# Altium project HLib-Sensor-Accel_Gyro.PrjPcb
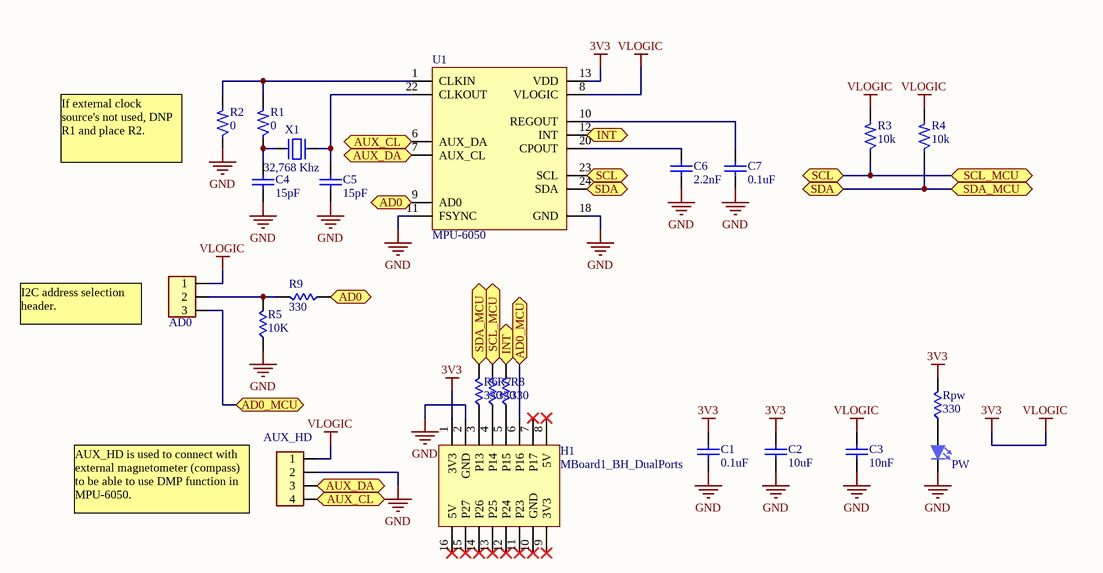
[diagram p0: HLib-Sensor-Accel_Gyro.SchDoc]
1 sheet, 23 parts. Net scope: flat (ports and power ports of the same name join across sheets).
Board file: HLib-Sensor-Accel_Gyro.PcbDoc

## Sheet HLib-Sensor-Accel_Gyro.SchDoc
size A4

### Parts
AD0  HEADER 3  [HD_MALE_3]  (value not drawn)
AUX_HD  HEADER 4  [HD_MALE_4]  (value not drawn)
C1  CAP  [SM_0805_C_CERAMIC]  (value not drawn)
C2  CAP  [SM_0805_C_CERAMIC]  (value not drawn)
C3  CAP  [SM_0805_C_CERAMIC]  (value not drawn)
C4  CAP  [SM_0805_C_CERAMIC]  (value not drawn)
C5  CAP  [SM_0805_C_CERAMIC]  (value not drawn)
C6  CAP  [SM_0805_C_CERAMIC]  (value not drawn)
C7  CAP  [SM_0805_C_CERAMIC]  (value not drawn)
H1  MBoard1_BH_DualPorts  [MBoard1_BH_DualPorts]
PW  LED  [SM_0805_LED]  (value not drawn)
R1  0  [SM-1206]
R2  0  [SM-1206]
R3  10k  [SM-1206]
R4  10k  [SM-1206]
R5  value 10K  [SM_0805_R]  (hidden comment: R)
R6  value 330  [SM_0805_R]  (hidden comment: R)
R7  value 330  [SM_0805_R]  (hidden comment: R)
R8  value 330  [SM_0805_R]  (hidden comment: R)
R9  value 330  [SM_0805_R]  (hidden comment: R)
Rpw  value 330  [SM_0805_R]  (hidden comment: R)
U1  MPU-6050  [QFN-24]
X1  32,768 Khz  [XT32k]

### Ports
AD0 (bidir), AD0_MCU (bidir), AUX_CL (bidir), AUX_DA (bidir), INT (bidir), SCL (bidir), SCL_MCU (bidir), SDA (bidir), SDA_MCU (bidir)

### Nets
3V3: AD0.1 AUX_HD.1 C1.2 C2.2 C3.2 H1.1(3V3) R3.2 R4.2 Rpw.2 U1.8(VLOGIC) U1.13(VDD)  [also labelled VLOGIC]
GND: AUX_HD.2 C1.1 C2.1 C3.1 C4.1 C5.1 C6.1 C7.1 H1.2(GND) PW.2(K) R2.1 R5.1 U1.11(FSYNC) U1.18(GND)
NetAD0_2: AD0.2 R5.2 R9.2
NetAD0_3: AD0.3 H1.6(P16) ; port AD0_MCU
NetAUX_HD_3: AUX_HD.3 U1.7(AUX_CL) ; port AUX_DA
NetAUX_HD_4: AUX_HD.4 U1.6(AUX_DA) ; port AUX_CL
NetC4_2: C4.2 R1.1 X1.2
NetC5_2: C5.2 U1.22(CLKOUT) X1.1
NetC6_2: C6.2 U1.20(CPOUT)
NetC7_2: C7.2 U1.10(REGOUT)
NetH1_3: H1.3(P13) R6.1
NetH1_4: H1.4(P14) R7.1
NetH1_5: H1.5(P15) R8.1
NetPW_1: PW.1(A) Rpw.1
NetR1_2: R1.2 R2.2 U1.1(CLKIN)
NetR3_1: R3.1 R7.2 U1.23(SCL) ; port SCL, port SCL_MCU
NetR4_1: R4.1 R6.2 U1.24(SDA) ; port SDA, port SDA_MCU
NetR8_2: R8.2 U1.12(INT) ; port INT
NetR9_1: R9.1 U1.9(AD0) ; port AD0

Not connected (* = marked no-connect by the designer): H1 7(P17)* 8(5V)* 9(3V3)* 10(GND)* 11(P23)* 12(P24)* 13(P25)* 14(P26)* 15(P27)* 16(5V)*

### Notes on the sheet
- (near R2) If external clock source's not used, DNP R1 and place R2.
- I2C address selection header.
- AUX_HD is used to connect with external magnetometer (compass) to be able to use DMP function in MPU-6050.
- (in symbol CAP) 15pF; 10nF; 0.1uF; 2.2nF; 10uF

### Library data of the parts
AD0 = HD_3: Header single row 3 pins
AUX_HD = HD_4: Header single row 4 pins
C1-C7 = CAP: Capacitor
R1-R4 = R: Resistor 1/4W; Value: R1/4W - 1K
R5-R9 Rpw = R: Resistor; Published: 8-Jun-2000; LatestRevisionDate: 29-May-2009; LatestRevisionNote: IPC-7351 Footprint Added.; PackageReference: J1-0603; Publisher: Altium Limited; PackageDescription: Chip Resistor
U1 = MPU_6050: Motion processing unit
X1 = XT32k: Crystal 32,768kHz for timer real; Value: 32,768khz
PW = LED: Published: 8-Jun-2000; LatestRevisionDate: 08-Jul-2005; LatestRevisionNote: Mech Layer 1 removed.; PackageReference: LED-1; Publisher: Altium Limited; PackageDescription: LED; 2 Leads